# EAGLE design usbmidi v2 (EAGLE 9.6.2)

## Sheet 1 of 2
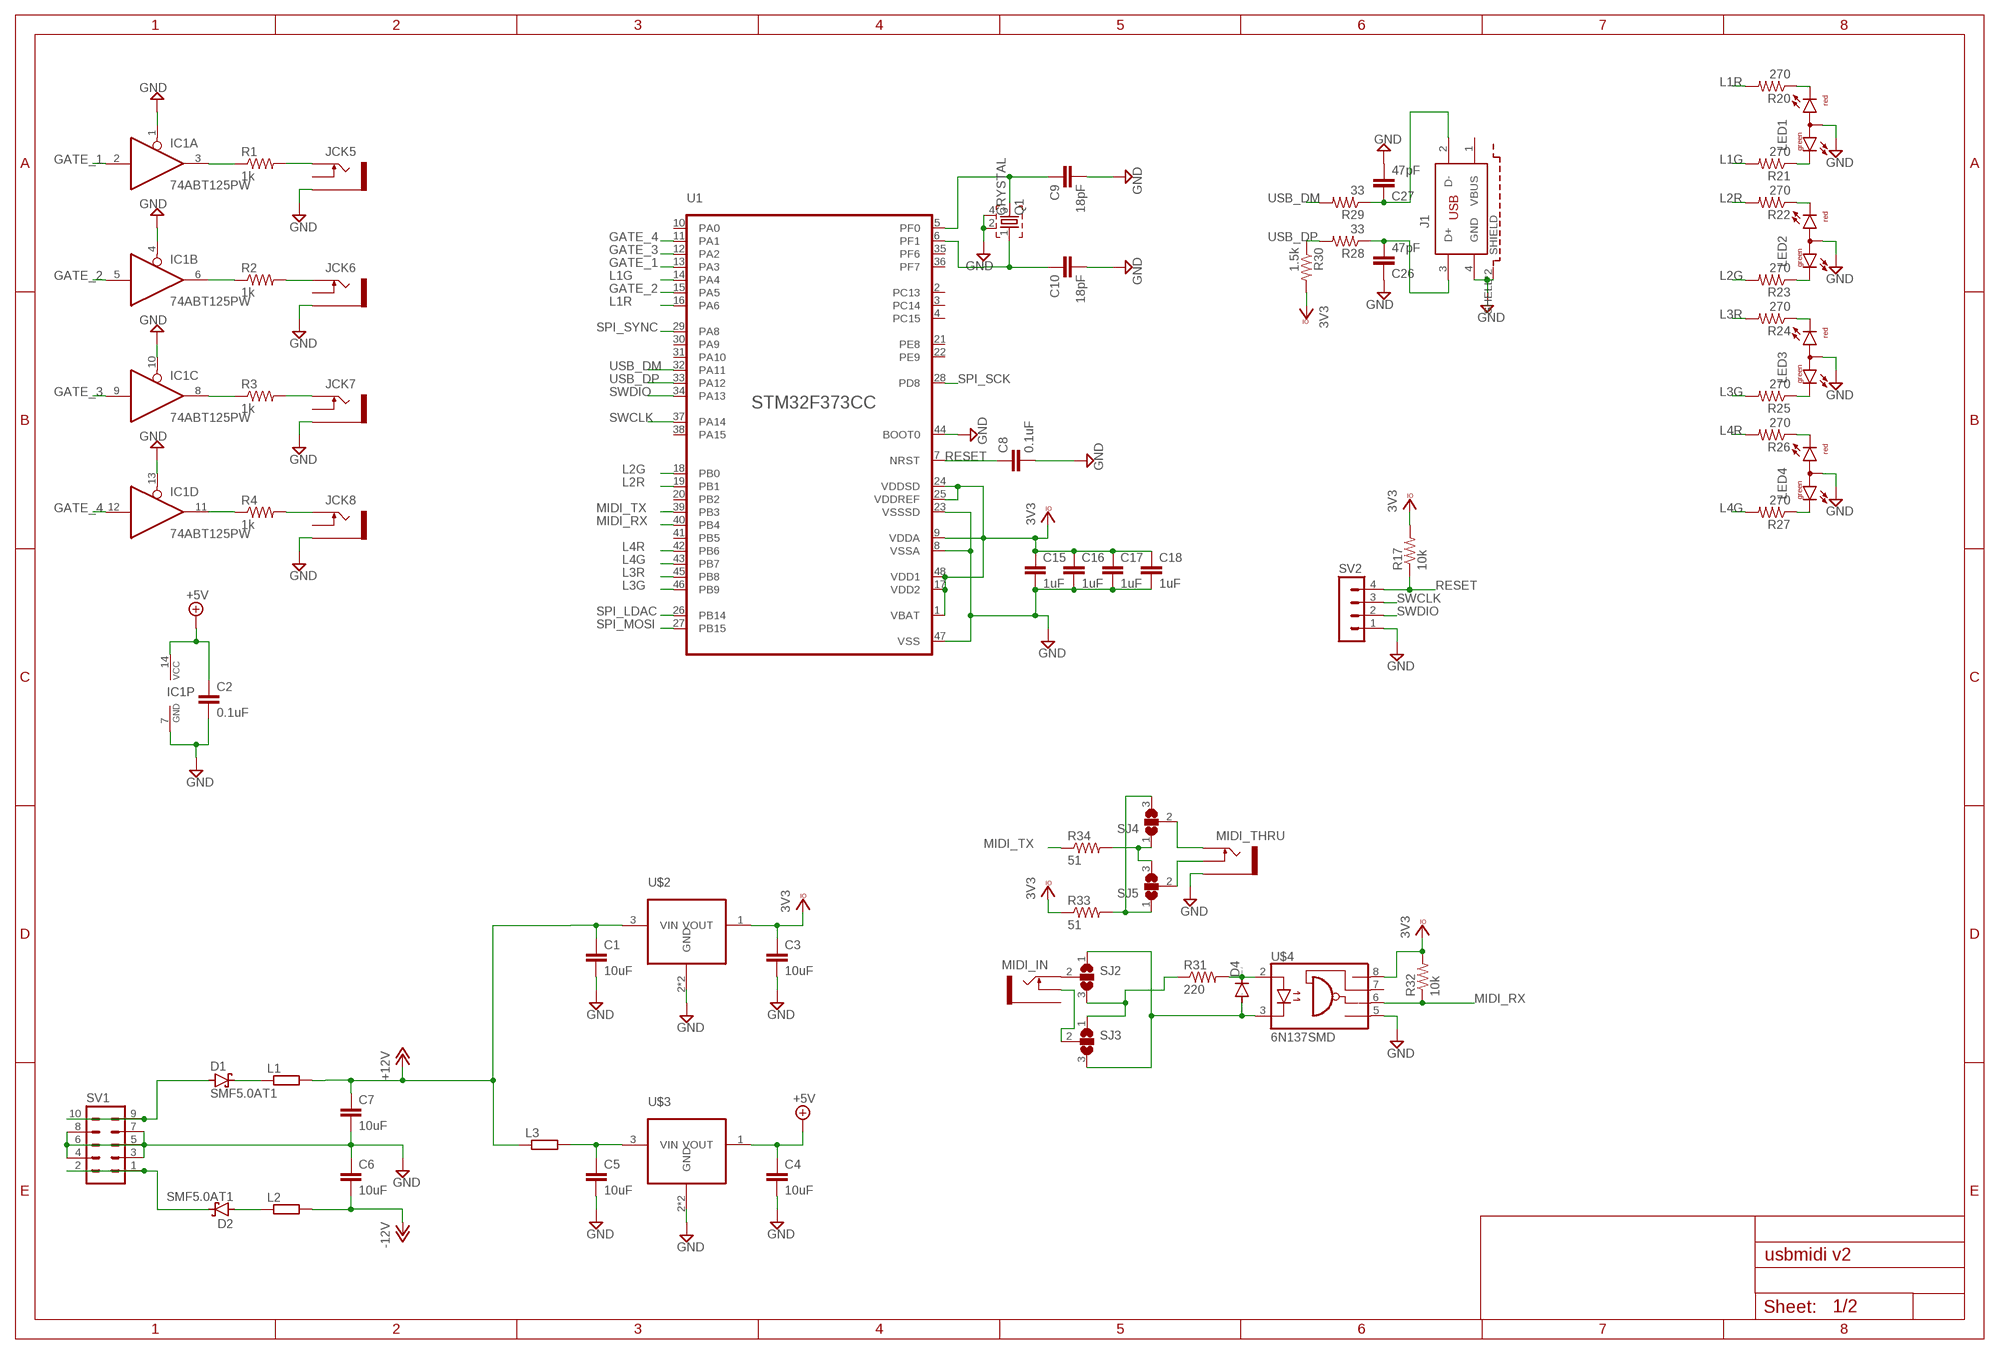
[diagram p0: schematic, sheet 1]

### Parts
C1  10uF  C-EUC0805  [C0805]
C2  0.1uF  C-EUC0603K  [C0603K]
C3  10uF  C-EUC0805  [C0805]
C4  10uF  C-EUC0805  [C0805]
C5  10uF  C-EUC0805  [C0805]
C6  10uF  C-EUC0805  [C0805]
C7  10uF  C-EUC0805  [C0805]
C8  0.1uF  C-EUC0603K  [C0603K]
C9  18pF  C-EUC0603K  [C0603K]
C10  18pF  C-EUC0603K  [C0603K]
C15  1uF  C-EUC0603K  [C0603K]
C16  1uF  C-EUC0603K  [C0603K]
C17  1uF  C-EUC0603K  [C0603K]
C18  1uF  C-EUC0603K  [C0603K]
C26  47pF  C-EUC0603K  [C0603K]
C27  47pF  C-EUC0603K  [C0603K]
D1  SMF5.0AT1  [SOD123FL]
D2  SMF5.0AT1  [SOD123FL]
D4  DIODE-SOD123  [SOD123]
IC1  74ABT125PW  [TSSOP14]
J1  61400413321  [61400413321]
JCK5  THONKICONNNEW  [WQP-PJ301M-12_JACK]
JCK6  THONKICONNNEW  [WQP-PJ301M-12_JACK]
JCK7  THONKICONNNEW  [WQP-PJ301M-12_JACK]
JCK8  THONKICONNNEW  [WQP-PJ301M-12_JACK]
L1  R-EU_R0603  [R0603]
L2  R-EU_R0603  [R0603]
L3  R-EU_R0603  [R0603]
LED1  L-115WEGW-CA  [DUOLED-A-3MM]
LED2  L-115WEGW-CA  [DUOLED-A-3MM]
LED3  L-115WEGW-CA  [DUOLED-A-3MM]
LED4  L-115WEGW-CA  [DUOLED-A-3MM]
MIDI_IN  THONKICONNNEW  [WQP-PJ301M-12_JACK]
MIDI_THRU  THONKICONNNEW  [WQP-PJ301M-12_JACK]
Q1  CRYSTAL  [CTS406]
R1  1k  R-US_R0603  [R0603]
R2  1k  R-US_R0603  [R0603]
R3  1k  R-US_R0603  [R0603]
R4  1k  R-US_R0603  [R0603]
R17  10k  R-US_R0603  [R0603]
R20  270  R-US_R0603  [R0603]
R21  270  R-US_R0603  [R0603]
R22  270  R-US_R0603  [R0603]
R23  270  R-US_R0603  [R0603]
R24  270  R-US_R0603  [R0603]
R25  270  R-US_R0603  [R0603]
R26  270  R-US_R0603  [R0603]
R27  270  R-US_R0603  [R0603]
R28  33  R-US_R0603  [R0603]
R29  33  R-US_R0603  [R0603]
R30  1.5k  R-US_R0603  [R0603]
R31  220  R-US_R0603  [R0603]
R32  10k  R-US_R0603  [R0603]
R33  51  R-US_R0603  [R0603]
R34  51  R-US_R0603  [R0603]
SJ2  SJ2W  [SJ_2]
SJ3  SJ2W  [SJ_2]
SJ4  SJ2W  [SJ_2]
SJ5  SJ2W  [SJ_2]
SV1  MA05-2  [MA05-2]
SV2  MA04-1  [MA04-1]
U1  STM32F373LQFP48  [LQFP48]
U$2  LD2981ABUSOT89  [SOT89]
U$3  LD2981ABUSOT89  [SOT89]
U$4  6N137SMD  [DIL8-SMD]

### Nets
+5V: C2.1 C4.1 IC1.14(P:VCC) U$3.1(VOUT) ; also sheet 2
+12V: C1.1 C7.1 L1.2 L3.1 U$2.3(VIN) ; also sheet 2
-12V: C6.2 L2.2 ; also sheet 2
GATE_1: IC1.2(A:I) U1.13(PA3)
GATE_2: IC1.5(B:I) U1.15(PA5)
GATE_3: IC1.9(C:I) U1.12(PA2)
GATE_4: IC1.12(D:I) U1.11(PA1)
GND: C1.2 C2.2 C3.2 C4.2 C5.2 C6.1 C7.2 C8.2 C9.2 C10.2 C15.2 C16.2 C17.2 C18.2 C26.1 C27.2 IC1.1(A:OE) IC1.4(B:OE) IC1.7(P:GND) IC1.10(C:OE) IC1.13(D:OE) J1.4(GND) J1.SHELL1(SHIELD) J1.SHELL(SHIELD) JCK5.P$3_SLEEVE(SLEEVE) JCK6.P$3_SLEEVE(SLEEVE) JCK7.P$3_SLEEVE(SLEEVE) JCK8.P$3_SLEEVE(SLEEVE) LED1.2(A) LED2.2(A) LED3.2(A) LED4.2(A) MIDI_THRU.P$3_SLEEVE(SLEEVE) Q1.2 Q1.4 SV1.3 SV1.4 SV1.5 SV1.6 SV1.7 SV1.8 SV2.1 U1.8(VSSA) U1.23(VSSSD) U1.44(BOOT0) U1.47(VSS) U$2.2(GND) U$2.2@1(GND) U$3.2(GND) U$3.2@1(GND) U$4.5(GND) ; also sheet 2
L1G: R21.2 U1.14(PA4)
L1R: R20.2 U1.16(PA6)
L2G: R23.2 U1.18(PB0)
L2R: R22.2 U1.19(PB1)
L3G: R25.2 U1.46(PB9)
L3R: R24.2 U1.45(PB8)
L4G: R27.2 U1.43(PB7)
L4R: R26.2 U1.42(PB6)
MIDI_RX: R32.1 U1.40(PB4) U$4.6(VO)
MIDI_TX: R34.1 U1.39(PB3)
N$1: C9.1 Q1.3 U1.5(PF0)
N$2: C26.2 J1.3(D+) R28.1
N$3: C5.1 L3.2 U$3.3(VIN)
N$4: C27.1 J1.2(D-) R29.1
N$5: IC1.3(A:O) R1.1
N$6: IC1.6(B:O) R2.1
N$7: IC1.8(C:O) R3.1
N$8: IC1.11(D:O) R4.1
N$9: JCK5.P$1_TIP(TIP) R1.2
N$10: JCK6.P$1_TIP(TIP) R2.2
N$11: JCK7.P$1_TIP(TIP) R3.2
N$12: JCK8.P$1_TIP(TIP) R4.2
N$16: D4.A SJ2.1 SJ3.3 U$4.3(C)
N$17: D1.C L1.1
N$18: D2.A L2.1
N$19: D2.C SV1.1 SV1.2
N$20: D1.A SV1.9 SV1.10
N$28: LED2.1(CG) R23.1
N$32: LED2.3(CR) R22.1
N$33: LED1.1(CG) R21.1
N$34: R31.1 SJ2.3 SJ3.1
N$35: D4.C R31.2 U$4.2(A)
N$36: MIDI_IN.P$1_TIP(TIP) SJ2.2
N$37: LED1.3(CR) R20.1
N$38: LED4.3(CR) R26.1
N$39: LED4.1(CG) R27.1
N$40: LED3.1(CG) R25.1
N$41: MIDI_IN.P$2_SWITCH(SWITCH) SJ3.2
N$42: LED3.3(CR) R24.1
N$43: C10.1 Q1.1 U1.6(PF1)
N$46: MIDI_THRU.P$2_SWITCH(SWITCH) SJ5.2
N$47: MIDI_THRU.P$1_TIP(TIP) SJ4.2
N$48: R34.2 SJ4.1 SJ5.3
N$49: R33.2 SJ4.3 SJ5.1
RESET: C8.1 R17.1 SV2.4 U1.7(NRST)
SPI_LDAC: U1.26(PB14) ; also sheet 2
SPI_MOSI: U1.27(PB15) ; also sheet 2
SPI_SCK: U1.28(PD8) ; also sheet 2
SPI_SYNC: U1.29(PA8) ; also sheet 2
SWCLK: SV2.3 U1.37(PA14)
SWDIO: SV2.2 U1.34(PA13)
USB_DM: R29.2 U1.32(PA11)
USB_DP: R28.2 R30.1 U1.33(PA12)
VCCIO: C3.1 C15.1 C16.1 C17.1 C18.1 R17.2 R30.2 R32.2 R33.1 U1.1(VBAT) U1.9(VDDA) U1.17(VDD2) U1.24(VDDSD) U1.25(VDDREF) U1.48(VDD1) U$2.1(VOUT) U$4.8(VCC) ; supply symbol labelled 3V3 ; also sheet 2
Unconnected: J1.1(VBUS) JCK5.P$2_SWITCH(SWITCH) JCK6.P$2_SWITCH(SWITCH) JCK7.P$2_SWITCH(SWITCH) JCK8.P$2_SWITCH(SWITCH) MIDI_IN.P$3_SLEEVE(SLEEVE) U1.2(PC13) U1.3(PC14) U1.4(PC15) U1.10(PA0) U1.20(PB2) U1.21(PE8) U1.22(PE9) U1.30(PA9) U1.31(PA10) U1.35(PF6) U1.36(PF7) U1.38(PA15) U1.41(PB5) U$4.7(VE)

## Sheet 2 of 2
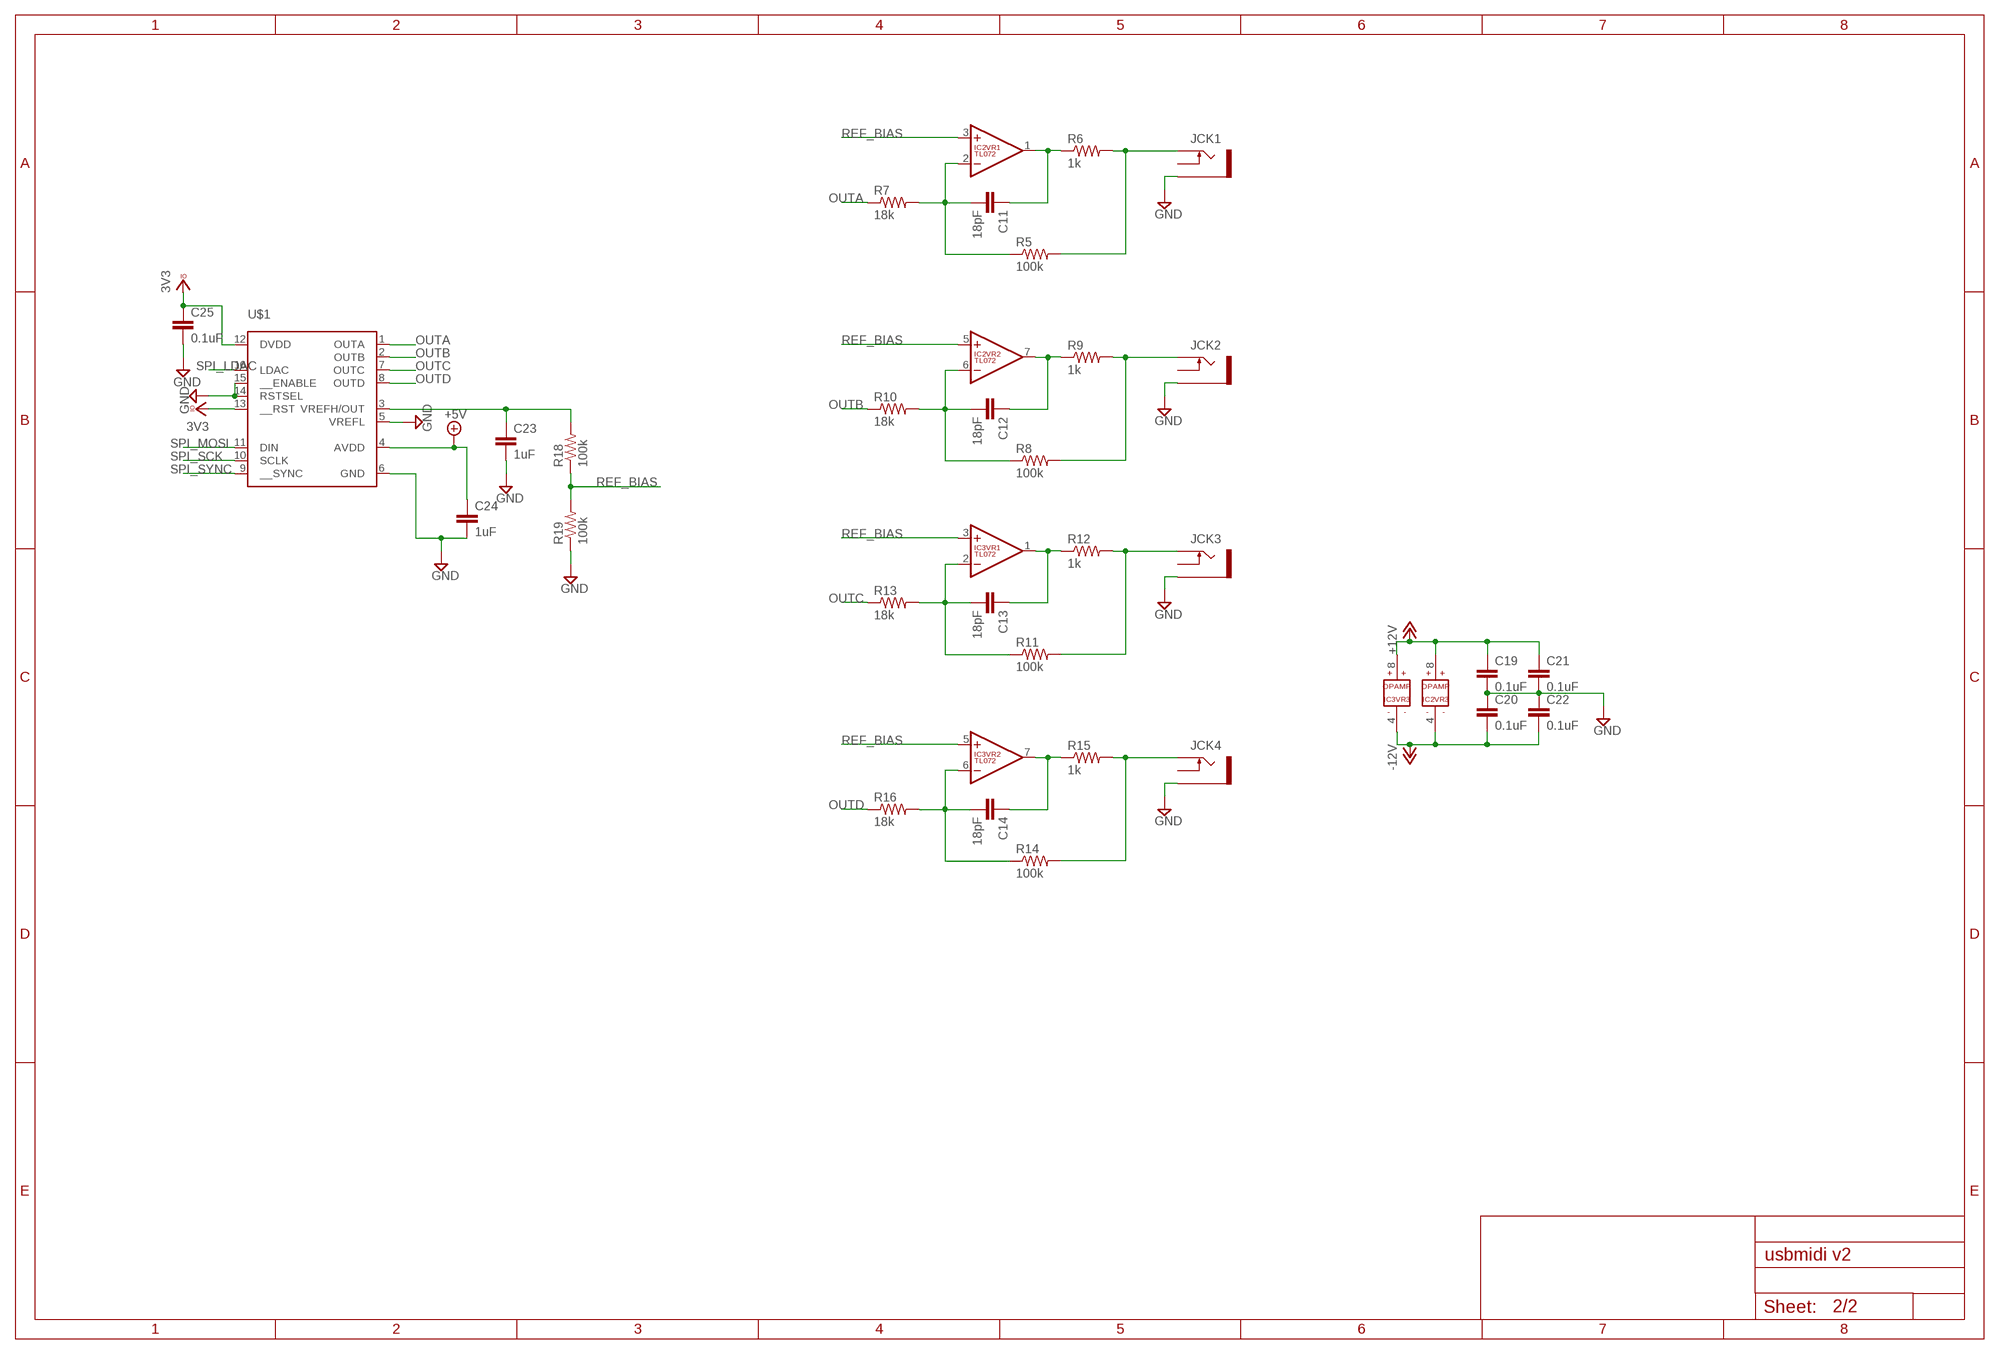
[diagram p1: schematic, sheet 2]

### Parts
C11  18pF  C-EUC0603K  [C0603K]
C12  18pF  C-EUC0603K  [C0603K]
C13  18pF  C-EUC0603K  [C0603K]
C14  18pF  C-EUC0603K  [C0603K]
C19  0.1uF  C-EUC0603K  [C0603K]
C20  0.1uF  C-EUC0603K  [C0603K]
C21  0.1uF  C-EUC0603K  [C0603K]
C22  0.1uF  C-EUC0603K  [C0603K]
C23  1uF  C-EUC0603K  [C0603K]
C24  1uF  C-EUC0603K  [C0603K]
C25  0.1uF  C-EUC0603K  [C0603K]
IC2  TL072  [SO08]
IC3  TL072  [SO08]
JCK1  THONKICONNNEW  [WQP-PJ301M-12_JACK]
JCK2  THONKICONNNEW  [WQP-PJ301M-12_JACK]
JCK3  THONKICONNNEW  [WQP-PJ301M-12_JACK]
JCK4  THONKICONNNEW  [WQP-PJ301M-12_JACK]
R5  100k  R-US_R0603  [R0603]
R6  1k  R-US_R0603  [R0603]
R7  18k  R-US_R0603  [R0603]
R8  100k  R-US_R0603  [R0603]
R9  1k  R-US_R0603  [R0603]
R10  18k  R-US_R0603  [R0603]
R11  100k  R-US_R0603  [R0603]
R12  1k  R-US_R0603  [R0603]
R13  18k  R-US_R0603  [R0603]
R14  100k  R-US_R0603  [R0603]
R15  1k  R-US_R0603  [R0603]
R16  18k  R-US_R0603  [R0603]
R18  100k  R-US_R0603  [R0603]
R19  100k  R-US_R0603  [R0603]
U$1  DAC8565  [TSSOP16]

### Nets
+5V: C24.1 U$1.4(AVDD) ; also sheet 1
+12V: C19.1 C21.1 IC2.8(VR3:V+) IC3.8(VR3:V+) ; also sheet 1
-12V: C20.2 C22.2 IC2.4(VR3:V-) IC3.4(VR3:V-) ; also sheet 1
GND: C19.2 C20.1 C21.2 C22.1 C23.2 C24.2 C25.2 JCK1.P$3_SLEEVE(SLEEVE) JCK2.P$3_SLEEVE(SLEEVE) JCK3.P$3_SLEEVE(SLEEVE) JCK4.P$3_SLEEVE(SLEEVE) R19.1 U$1.5(VREFL) U$1.6(GND) U$1.14(RSTSEL) U$1.15(__ENABLE) ; also sheet 1
N$13: C11.2 IC2.2(VR1:-IN) R5.1 R7.2
N$14: C11.1 IC2.1(VR1:OUT) R6.1
N$15: JCK1.P$1_TIP(TIP) R5.2 R6.2
N$21: C12.2 IC2.6(VR2:-IN) R8.1 R10.2
N$22: C12.1 IC2.7(VR2:OUT) R9.1
N$23: JCK2.P$1_TIP(TIP) R8.2 R9.2
N$24: C23.1 R18.2 U$1.3(VREFH/OUT)
N$25: C13.2 IC3.2(VR1:-IN) R11.1 R13.2
N$26: C13.1 IC3.1(VR1:OUT) R12.1
N$27: JCK3.P$1_TIP(TIP) R11.2 R12.2
N$29: C14.2 IC3.6(VR2:-IN) R14.1 R16.2
N$30: C14.1 IC3.7(VR2:OUT) R15.1
N$31: JCK4.P$1_TIP(TIP) R14.2 R15.2
OUTA: R7.1 U$1.1(OUTA)
OUTB: R10.1 U$1.2(OUTB)
OUTC: R13.1 U$1.7(OUTC)
OUTD: R16.1 U$1.8(OUTD)
REF_BIAS: IC2.3(VR1:+IN) IC2.5(VR2:+IN) IC3.3(VR1:+IN) IC3.5(VR2:+IN) R18.1 R19.2
SPI_LDAC: U$1.16(LDAC) ; also sheet 1
SPI_MOSI: U$1.11(DIN) ; also sheet 1
SPI_SCK: U$1.10(SCLK) ; also sheet 1
SPI_SYNC: U$1.9(__SYNC) ; also sheet 1
VCCIO: C25.1 U$1.12(DVDD) U$1.13(__RST) ; supply symbol labelled 3V3 ; also sheet 1
Unconnected: JCK1.P$2_SWITCH(SWITCH) JCK2.P$2_SWITCH(SWITCH) JCK3.P$2_SWITCH(SWITCH) JCK4.P$2_SWITCH(SWITCH)

## Library data of the parts
C1-C27 = resistor:C-EU: CAPACITOR, European symbol
D1 D2 = diode:SMF5.0AT1: 200 W Transient Voltage Suppressor Source: Data sheet <http://www.onsemi.com/pub_link/Collateral/SMF5.0AT1-D.PDF>
D4 = diode:DIODE-: DIODE
IC1 = 74xx-eu:74*125: Quad bus BUFFER, 3-state
IC2 IC3 = EurorackModularParts:TL072
J1 = Wurth_Elektronik_Electromechanic_Input-Output_Connectors_rev19a:61400413321: WR-COM Vertical USB Type B,4 pins=>Code : Con_I-O_COM_USB-2.0_B_61400413321 <http://katalog.we-online.de/media/images/v2/Family_S290_WR-COM_USB_TypeB_61400413321_4C.jpg> Details see: http://katalog.we-online.de/en/em/COM_TYPE_B_VERTICAL Created 2014-07-09, Karrer Zheng 2014 (C) Würth Elektronik
JCK1-JCK8 MIDI_IN MIDI_THRU = BitFox:THONKICONN: 3.5mm socket for Eurorack modular synths
L1-L3 = resistor:R-EU_: RESISTOR, European symbol
LED1-LED4 = led:L-115WEGW-CA: T-1(3mm) BI-COLOR INDICATOR LAMP Source: Kingbright .. 2_colour_led_.pdf
Q1 = BitFox:CRYSTAL
R1-R34 = resistor:R-US_: RESISTOR, American symbol
SJ2-SJ5 = jumper:SJ2W: SMD solder JUMPER
SV1 = con-lstb:MA05-2: PIN HEADER; OC_FARNELL: unknown; OC_NEWARK: unknown
SV2 = con-lstb:MA04-1: PIN HEADER; OC_FARNELL: unknown; OC_NEWARK: unknown
U1 = BitFox:STM32F373
U$1 = BitFox:DAC8565
U$2 U$3 = BitFox:LD2981ABU
U$4 = optocoupler:6N137SMD

## Board
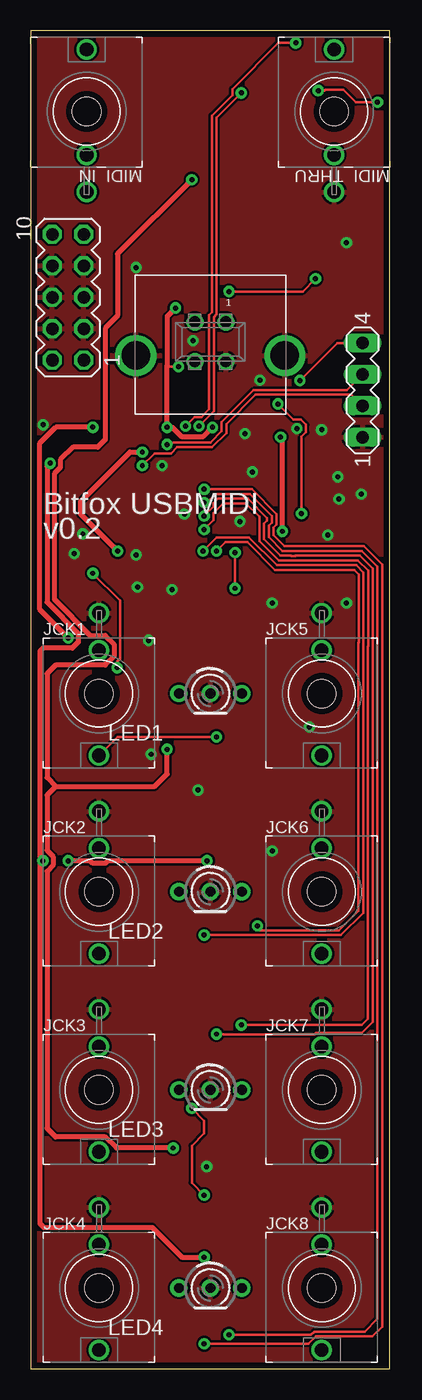
[diagram p2: board, top side]
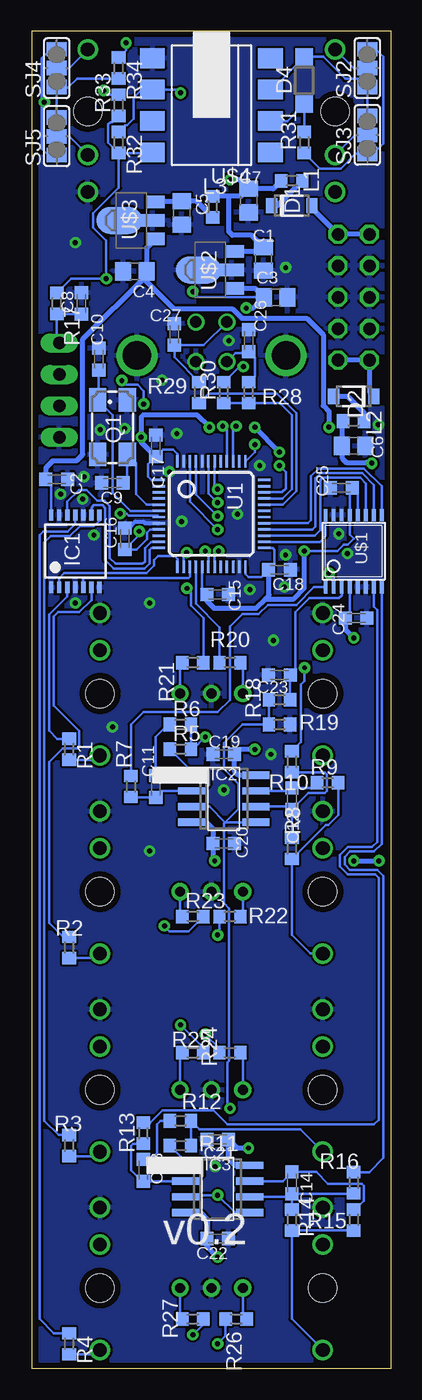
[diagram p3: board, bottom side, seen from below]

Size 29 x 108 mm. Coordinates in mm from the lower left corner, seen from the top.
Outline: 0,0 29,0 29,108 0,108 0,0
Copper layers (1*16): Top 0.035mm / dielectric 1.5mm / Bottom 0.035mm
Design rules "PCBCart-Standard *": minimum track width 7mil, minimum drill 0.4mm, track to track 7mil, track to pad 7mil, pad to pad 7mil, via to via 7mil, smd to smd 7mil, copper to edge 20mil, drill to drill 8mil, minimum pad ring 8mil, minimum via ring 10mil, stop-mask expansion 3mil, vias tented up to drill 25mil, thermal gap 8mil

### Footprints (pad centres in the part's own frame; a part is rotated, then mirrored left to right if it is on the bottom)
C0805 = smd 1.3 x 1.5: 1 -0.95,0; 2 0.95,0
C0603K = smd 1.05 x 1.08: 1 -0.875,0; 2 0.875,0
SOD123FL = smd 0.91 x 1.22: A 1.625,0; C -1.625,0
SOD123 = smd 1.4 x 1.4: A 1.9,0; C -1.9,0
TSSOP14 = smd 0.35 x 0.9: 1 -1.95,-2.925; 2 -1.3,-2.925; 3 -0.65,-2.925; 4 0,-2.925; 5 0.65,-2.925; 6 1.3,-2.925; 7 1.95,-2.925; 8 1.95,2.925; 9 1.3,2.925; 10 0.65,2.925; 11 0,2.925; 12 -0.65,2.925; 13 -1.3,2.925; 14 -1.95,2.925
SO08 = smd 0.6 x 2.2: 1 -1.905,-2.6; 2 -0.635,-2.6; 3 0.635,-2.6; 4 1.905,-2.6; 5 1.905,2.6; 6 0.635,2.6; 7 -0.635,2.6; 8 -1.905,2.6
61400413321 = drill 0.92: 1 1.25,0; 2 -1.25,0; 3 -1.25,-3.2; 4 1.25,-3.2 | drill 2.3: SHELL -6.02,-2.7; SHELL1 6.02,-2.7
WQP-PJ301M-12_JACK = drill 1.1: P$1_TIP 0,5; P$2_SWITCH 0,-3.5; P$3_SLEEVE 0,-6.5 | hole 2.286: 0,0
R0603 = smd 1 x 1.1: 1 -0.85,0; 2 0.85,0
DUOLED-A-3MM = drill 0.8 pad 1.4: 1 -2.54,0; 2 0,0; 3 2.54,0
CTS406 = smd 1.9 x 1.4: 1 -2.2,-1.2; 2 2.2,-1.2; 3 2.2,1.2; 4 -2.2,1.2
SJ_2 = smd 1.168 x 1.6: 1 -1.524,0; 2 0,0; 3 1.524,0
MA05-2 = drill 1.016 octagon: 1 -5.08,-1.27; 2 -5.08,1.27; 3 -2.54,-1.27; 4 -2.54,1.27; 5 0,-1.27; 6 0,1.27; 7 2.54,-1.27; 8 2.54,1.27; 9 5.08,-1.27; 10 5.08,1.27
MA04-1 = drill 1.016 long: 1 -3.81,0; 2 -1.27,0; 3 1.27,0; 4 3.81,0
LQFP48 = smd 1 x 0.2: 1 -4.25,2.75; 2 -4.25,2.25; 3 -4.25,1.75; 4 -4.25,1.25; 5 -4.25,0.75; 6 -4.25,0.25; 7 -4.25,-0.25; 8 -4.25,-0.75; 9 -4.25,-1.25; 10 -4.25,-1.75; 11 -4.25,-2.25; 12 -4.25,-2.75; 25 4.25,-2.75; 26 4.25,-2.25; 27 4.25,-1.75; 28 4.25,-1.25; 29 4.25,-0.75; 30 4.25,-0.25; 31 4.25,0.25; 32 4.25,0.75; 33 4.25,1.25; 34 4.25,1.75; 35 4.25,2.25; 36 4.25,2.75 | smd 0.2 x 1: 13 -2.75,-4.25; 14 -2.25,-4.25; 15 -1.75,-4.25; 16 -1.25,-4.25; 17 -0.75,-4.25; 18 -0.25,-4.25; 19 0.25,-4.25; 20 0.75,-4.25; 21 1.25,-4.25; 22 1.75,-4.25; 23 2.25,-4.25; 24 2.75,-4.25; 37 2.75,4.25; 38 2.25,4.25; 39 1.75,4.25; 40 1.25,4.25; 41 0.75,4.25; 42 0.25,4.25; 43 -0.25,4.25; 44 -0.75,4.25; 45 -1.25,4.25; 46 -1.75,4.25; 47 -2.25,4.25; 48 -2.75,4.25
TSSOP16 = smd 0.305 x 0.991: 1 -2.275,-2.918; 2 -1.625,-2.918; 3 -0.975,-2.918; 4 -0.325,-2.918; 5 0.325,-2.918; 6 0.975,-2.918; 7 1.625,-2.918; 8 2.275,-2.918; 9 2.275,2.918; 10 1.625,2.918; 11 0.975,2.918; 12 0.325,2.918; 13 -0.325,2.918; 14 -0.975,2.918; 15 -1.625,2.918; 16 -2.275,2.918
SOT89 = smd 1 x 1.5: 1 -1.499,-1.981; 3 1.499,-1.981 | smd 1 x 2: 2 0,-1.727 | smd 2.2 x 3.7: 2@1 0,0.94
DIL8-SMD = smd 1.6 x 2: 1 -3.81,-4.77; 2 -1.27,-4.77; 3 1.27,-4.77; 4 3.81,-4.77; 5 3.81,4.77; 6 1.27,4.77; 7 -1.27,4.77; 8 -3.81,4.77

### Placement (x,y rotation side)
C1  10.3,89.6 270 bottom
C2  27,71.8 0 bottom
C3  9.3,86.5 0 bottom
C4  20.7,88.6 180 bottom
C5  16.9,93.3 270 bottom
C6  3,74.5 180 bottom
C7  11.5,94.3 270 bottom
C8  25,86 90 bottom
C9  22.5,71.5 180 bottom
C10  23.6,81.5 90 bottom
C11  19,47 270 bottom
C12  8,46 270 bottom
C13  20,16 270 bottom
C14  8,15 270 bottom
C15  14,62.5 0 bottom
C16  21.5,67 90 bottom
C17  19,74.5 90 bottom
C18  9,64.5 0 bottom
C19  13.5,49.6 180 bottom
C20  13.5,42.4 180 bottom
C21  14,18.5 180 bottom
C22  14,10.5 180 bottom
C23  9,56 180 bottom
C24  2.8,60.6 0 bottom
C25  4,71.1 180 bottom
C26  11.5,83 270 bottom
C27  17.5,83.5 90 bottom
D1  8,93.9 0 bottom
D2  3,78.5 180 bottom
D4  7,104 90 bottom
IC1  25.5,66 0 bottom
IC2  13.5,46 270 bottom
IC3  14,14.5 270 bottom
J1  14.5,84.5 0 top
JCK1  5.5,54.5 180 top
JCK2  5.5,38.5 180 top
JCK3  5.5,22.5 180 top
JCK4  5.5,6.5 180 top
JCK5  23.5,54.5 180 top
JCK6  23.5,38.5 180 top
JCK7  23.5,22.5 180 top
JCK8  23.5,6.5 180 top
L1  8,95.9 180 bottom
L2  3,76.5 180 bottom
L3  14.4,93.8 270 bottom
LED1  14.5,54.5 180 top
LED2  14.5,38.5 180 top
LED3  14.5,22.5 180 top
LED4  14.5,6.5 180 top
MIDI_IN  4.5,101.5 0 top
MIDI_THRU  24.5,101.5 0 top
Q1  22.5,76 270 bottom
R1  26,50 270 bottom
R2  26,34 270 bottom
R3  26,18 270 bottom
R4  26,2 270 bottom
R5  17,50 0 bottom
R6  17,52 0 bottom
R7  21,47 270 bottom
R8  8,42 270 bottom
R9  5.1,47.3 0 bottom
R10  8,49 270 bottom
R11  17,18 0 bottom
R12  17,20 0 bottom
R13  20,19 270 bottom
R14  8,12 270 bottom
R15  3,12 270 bottom
R16  3,15 270 bottom
R17  27,86 90 bottom
R18  9,54 0 bottom
R19  9,52 180 bottom
R20  13,57 180 bottom
R21  16,57 0 bottom
R22  13,36.5 180 bottom
R23  16,36.5 0 bottom
R24  13,25.5 180 bottom
R25  16,25.5 0 bottom
R26  12.5,4 180 bottom
R27  16,4 0 bottom
R28  11.5,78.8 270 bottom
R29  15.5,78.8 270 bottom
R30  13.5,78.8 90 bottom
R31  7,99 90 bottom
R32  22,99 270 bottom
R33  22,102 90 bottom
R34  22,105 270 bottom
SJ2  1.9,105 90 bottom
SJ3  1.9,99.6 90 bottom
SJ4  27,105 90 bottom
SJ5  27,99.5 90 bottom
SV1  3,86.5 90 top
SV2  26.8,79 90 top
U1  14.5,69 0 bottom
U$1  3,66 0 bottom
U$2  14.6,88.7 90 bottom
U$3  21,92.7 90 bottom
U$4  14.5,102 90 bottom

### Tracks (layer width: path | path; a pad name or v marks a point on that pad's centre or on a via)
+5V  (via drill 0.4)
  Top 0.406: v5,76 2,76 0.71,74.71 0.71,61.29 v3,59
  Bottom 0.203: C24.1 3.33,60.95 U$1.4 | IC1.14 27.45,71.38 C2.1
  Bottom 0.406: U$3.1 19.75,90.47 C4.1 | C4.1 19.75,88.25 24.89,83.11 24.89,73.81 25.4,73.3 27.3,73.3 27.88,72.72 C2.1 | v5,76 5,77.27 5.46,77.73 5.46,83.46 6.8,84.8 12.04,84.8 12.81,85.57 17.57,85.57 19.75,87.75 C4.1 | C24.1 3.67,59.67 v3,59
+12V  (via drill 0.4)
  Top 0.406: v13,96 7,90 7,85 6,84 6,75 5.4,74.4 3.4,74.4 2.38,73.38 2.38,72.75 1.88,72.25 1.88,62.13 4.8,59.21 6,59.21 6.71,58.5 6.71,57.5 6,56.79 1.99,56.79 1.29,56.1 1.29,47.7 2,47 | 2,47 1.29,46.3 1.29,41.85 1.8,41.35 1.8,40.65 1.29,40.15 1.29,19.4 1.99,18.71 6,18.71 6.91,17.8 v11.5,17.8 | 2,47 10,47 11,48 v11,50
  Bottom 0.406: L1.2 9.5,95.25 C7.1 | C7.1 12.1,94.65 13.1,94.65 | 13.1,94.65 L3.1 | U$2.3 10.65,90.2 C1.1 11.25,91.5 12.8,91.5 13.1,91.8 13.1,94.65 | C7.1 12.25,96 v13,96 | IC2.8 12.3,47.91 12.62,48.23 C19.1 12.22,50 v11,50 | IC3.8 12.61,16.41 13.12,16.93 C21.1 12.43,17.8 v11.5,17.8
-12V  (via drill 0.4)
  Top 0.406: v1.55,73.1 1.29,72.84 1.29,61.88 3.83,59.35 3.83,58.65 3.35,58.16 0.98,58.16 0.71,57.9 0.71,41.25 | v14.23,41 6.21,41 6,40.79 5,40.79 4.79,41 v3,41 | 0.71,41.25 0.71,40.75 | v14,9 12.2,9 9.8,11.4 1.02,11.4 0.71,11.71 0.71,40 0.71,40.75 | 0.71,41.25 v0.96,41 0.71,40.75
  Bottom 0.406: L2.2 3.95,76.4 C6.2 3.95,73.51 3.6,73.16 1.97,73.16 1.9,73.1 v1.55,73.1 | IC2.4 14.89,44.09 14.38,43.58 C20.2 14.38,41.14 v14.23,41 | IC3.4 15.39,12.6 14.8,12 14.8,10.57 C22.2 14.88,9.88 v14,9 | v3,41 v0.96,41
GATE_1
  Bottom 0.203: IC1.2 26.8,63.8 26.38,64.22 19.74,64.22 19.12,64.84 19.12,65.3 18.82,65.6 17.5,65.6 17.25,65.35 U1.13
GATE_2
  Bottom 0.203: IC1.5 24.85,63.79 24.8,63.84 18,63.84 17.98,63.84 16.36,63.84 16.25,63.95 U1.15
GATE_3
  Bottom 0.203: U1.12 19.35,66.25 19.5,66.1 19.5,65 19.9,64.6 22.4,64.6 23.1,65.3 23.1,69.49 23.3,69.7 24,69.7 24.2,69.5 IC1.9
GATE_4
  Bottom 0.203: U1.11 19.39,66.75 19.88,66.26 19.88,65.16 20.06,64.98 22.24,64.98 22.71,65.45 22.71,69.65 23.15,70.08 23.74,70.08 24.6,70.93 25.2,70.93 26.15,69.99 IC1.12
GND  (via drill 0.4)
  Bottom 0.305: C16.2 21.16,67.88 20.65,68.38 20,68.38 19.87,68.25 U1.8
  other vias: 25.5,61.8 19.5,61.8 23.5,75.8 18.5,79.8 13.1,83 8.5,88.9 25.5,90.9 24,67.3 24.9,70.2 16.9,68.4 12.4,69 10.6,72.9 17.9,72.4 17.3,75.5 21.5,75.9 9.5,58.8 3.5,65.8 11.4,62.9 8.5,65.7 8.6,63.1 4.2,67.4 24.8,72 26.7,70.6 22.5,51.8 19.5,41.8 14.2,16.3 13.5,46.7 9.7,49.6 1,76.2
  pour Bottom: 29,108 29,0 0,0 0,108
  pour Top: 29,108 29,0 0,0 0,108
L1G  (via drill 0.4)
  Top 0.203: v16.5,65.88 16.5,63.02 v16.48,63
  Bottom 0.203: R21.2 15.15,60.61 16.13,61.59 16.13,62.65 v16.48,63 | U1.14 16.75,65.63 v16.5,65.88
L1R
  Bottom 0.203: U1.16 15.75,61.75 13.85,59.85 R20.2
L2G  (via drill 0.4)
  Top 0.203: v15,66 15.72,66.72 17.48,66.72 19.72,64.48 26.12,64.48 26.48,64.11 26.48,58.64 26.48,58.63 26.48,36.96 24.9,35.38 18.5,35.38 18.3,35.58 v18.3,35.73
  Bottom 0.203: U1.18 14.75,65.75 v15,66 | v18.3,35.73 17.87,35.3 16.35,35.3 R23.2
L2R  (via drill 0.4)
  Top 0.203: v13.91,66 15.01,67.1 17.64,67.1 19.88,64.86 26.28,64.86 26.87,64.27 26.87,58.48 26.86,58.47 26.86,36.8 25.06,35 v14,35
  Bottom 0.203: U1.19 14.25,65.66 v13.91,66 | v14,35 13.85,35.15 R22.2
L3G  (via drill 0.4)
  Top 0.203: v14,67.74 14,67.79 14.73,68.53 14.73,69.07 15.52,69.86 17.37,69.86 18.45,68.78 18.45,66.82 20.04,65.24 26.44,65.24 27.25,64.43 27.25,58.33 27.24,58.32 27.24,28.24 26.73,27.73 v17,27.73
  Bottom 0.203: U1.46 16.25,69.99 v14,67.74 | v17,27.73 15.15,25.88 R25.2
L3R  (via drill 0.4)
  Top 0.203: v14,68.83 14,68.88 14.73,69.61 14.73,69.87 15.1,70.24 17.53,70.24 19.08,68.68 19.08,68.47 18.83,68.22 18.83,66.98 20.18,65.64 21.02,65.64 21.04,65.62 21.36,65.62 21.38,65.64 26.57,65.64 27.63,64.58 27.63,58.17 27.62,58.16 27.62,28 26.72,27.1 23.04,27.1 22.94,27 v15,27
  Bottom 0.203: U1.45 15.75,70.58 v14,68.83 | v15,27 13.85,25.85 R24.2
L4G  (via drill 0.4)
  Top 0.203: v14,69.91 14.21,69.91 14.92,70.62 17.69,70.62 19.46,68.84 19.46,68.31 19.21,68.06 19.21,67.14 20.33,66.02 21.18,66.02 26.73,66.02 28.01,64.74 28.01,58.01 28,58 28,4 26.98,2.98 22.89,2.98 22.63,2.73 v16,2.73
  Bottom 0.203: U1.43 14.75,70.66 v14,69.91 | v16,2.73 15.15,3.58 R27.2
L4R  (via drill 0.4)
  Top 0.203: v14,71 17.85,71 19.85,69 19.85,68.16 19.59,67.9 19.59,67.3 20.49,66.4 26.89,66.4 28.39,64.9 28.39,58 28.39,57.8 28.39,3.39 27.6,2.6 23.04,2.6 22.44,2 v14,2
  Bottom 0.203: U1.42 14.25,71.25 v14,71 | v14,2 13.35,2.65 R26.2
MIDI_RX  (via drill 0.4)
  Top 0.203: v13.59,76.1 14.78,77.3 14.78,84.9 15,85.12 15,101 v17,103
  Bottom 0.203: R32.1 21.48,100.37 21.33,100.37 20.8,100.91 20.8,102.6 20.13,103.27 U$4.6 17.27,103.27 v17,103 | U1.40 13.25,75.76 v13.59,76.1
MIDI_TX  (via drill 0.4)
  Top 0.203: v12.5,76.1 13.23,76.83 13.78,76.83 14.4,77.45 14.4,85.06 14.62,85.28 14.62,101.16 16.27,102.81 16.27,103.3 20,107.04 v21.4,107.04
  Bottom 0.203: U1.39 12.75,75.85 v12.5,76.1 | v21.4,107.04 21.4,106.45 R34.1
N$1
  Bottom 0.203: U1.5 19.75,69.75 20.6,70.6 20.6,73.1 Q1.3 21.3,71.83 C9.1
N$2
  Bottom 0.203: J1.3 12.55,82 11.5,82 C26.2 11,81.62 11,80.15 R28.1
N$3
  Bottom 0.406: L3.2 15.7,94.25 C5.1 16.95,94.2 U$3.3
N$4
  Bottom 0.203: J1.2 15.12,82.62 C27.1 17.5,81.65 R29.1
N$5
  Bottom 0.203: IC1.3 26.15,62.35 27.63,60.87 27.63,51.53 26.95,50.85 R1.1
N$6
  Bottom 0.203: IC1.6 24.2,63 24.2,62.6 24.2,62.06 25.2,61.07 26.89,61.07 27.25,60.71 27.25,53.54 25.17,51.47 25.17,50.23 25.33,50.07 26.52,50.07 27.63,48.97 27.63,36 26.48,34.85 R2.1
N$7
  Bottom 0.203: R3.1 26.85,18.85 28.01,20.01 28.01,66.7 27.49,67.22 25.94,67.22 25.13,68.03 24,68.03 23.55,68.48 IC1.8
N$8
  Bottom 0.203: IC1.11 25.5,68.2 26.1,67.6 28.1,67.6 28.39,67.31 28.39,4 27.24,2.85 R4.1
N$9
  Bottom 0.203: R1.2 23.85,49.15 JCK5.P$1_TIP
N$10
  Bottom 0.203: R2.2 23.85,33.15 JCK6.P$1_TIP
N$11
  Bottom 0.203: R3.2 23.85,17.15 JCK7.P$1_TIP
N$12
  Bottom 0.203: R4.2 23.85,1.15 JCK8.P$1_TIP
N$13
  Bottom 0.203: R7.2 20.98,46.12 C11.2 18.49,46.63 IC2.2 15.16,46.63 14.7,47.1 14.7,48.3 14.88,48.48 16.33,48.48 R5.1
N$14
  Bottom 0.203: IC2.1 18.97,47.91 C11.1 19,51 18,52 R6.1
N$15  (via drill 0.4)
  Top 0.203: v15,51 7,51 JCK1.P$1_TIP
  Bottom 0.203: R6.2 R5.2 16,50 v15,51
N$16
  Bottom 0.203: SJ3.3 SJ2.1 2.56,104.14 3.7,104.14 5.46,105.9 D4.A 9.63,103.27 U$4.3
N$17
  Bottom 0.406: D1.C 9.15,93.9 L1.1
N$18
  Bottom 0.406: D2.A 3.5,78.5 2.15,77.15 L2.1
N$19
  Bottom 0.406: SV1.1 SV1.2 1.73,78.86 D2.C
N$20
  Bottom 0.406: SV1.10 SV1.9 6.38,93.69 D1.A
N$21
  Bottom 0.203: IC2.6 8.24,45.37 C12.2 | C12.2 6.65,46.47 5.33,46.47 5.17,46.63 5.17,47.97 5.33,48.13 7.98,48.13 R10.2 | R8.1 C12.2
N$22
  Bottom 0.203: IC2.7 8.24,46.63 C12.1 6.38,46.88 R9.1
N$23
  Bottom 0.203: R9.2 4.25,44.69 5.04,43.9 5.25,43.9 R8.2 8,35 6.5,33.5 JCK2.P$1_TIP
N$24
  Bottom 0.203: U$1.3 3.98,62.42 4.2,62.2 6.58,62.2 7.7,61.08 7.7,56.42 C23.1 8.15,55.98 R18.2
N$25
  Bottom 0.203: R13.2 20.85,18.15 21,18 21,16 20.12,15.12 C13.2 16.7,15.12 IC3.2 | IC3.2 | R11.1 16.83,16.98 15.38,16.98 15.22,16.82 15.22,15.58 15.68,15.12 IC3.2
N$26
  Bottom 0.203: IC3.1 19.53,16.41 C13.1 19.88,17 19.3,17 18.9,17.4 18.9,19.7 18.6,20 R12.1
N$27
  Bottom 0.203: R11.2 R12.2 15.47,19.32 7.32,19.32 JCK3.P$1_TIP
N$28
  Bottom 0.203: LED2.1 17.04,36.69 R23.1
N$29
  Bottom 0.203: C14.2 8.26,13.87 IC3.6 | C14.2 R14.1 | C14.2 3.02,14.12 R16.2
N$30
  Bottom 0.203: IC3.7 8.74,15.13 C14.1 6.03,15.88 5.08,14.93 2.33,14.93 2.17,14.77 2.17,13.53 2.85,12.85 R15.1
N$31
  Bottom 0.203: R15.2 R14.2 8,4 JCK4.P$1_TIP
N$32
  Bottom 0.203: R22.1 11.96,36.69 LED2.3
N$33
  Bottom 0.203: R21.1 17.04,56.81 LED1.1
N$34
  Bottom 0.203: SJ2.3 1.23,106.52 0.61,105.9 0.61,98.9 1.43,98.08 SJ3.1 2.86,98.08 4.04,96.9 5.75,96.9 R31.1
N$35
  Bottom 0.203: R31.2 D4.C 8.37,100.73 U$4.2
N$36
  Bottom 0.203: MIDI_IN.P$1_TIP 3,105 SJ2.2
N$37
  Bottom 0.203: LED1.3 11.96,56.81 R20.1
N$38
  Bottom 0.203: LED4.3 11.96,4.31 R26.1
N$39
  Bottom 0.203: LED4.1 17.04,4.19 R27.1
N$40
  Bottom 0.203: R25.1 17.04,25.31 LED3.1
N$41
  Bottom 0.203: MIDI_IN.P$2_SWITCH 2.9,99.6 SJ3.2
N$42
  Bottom 0.203: LED3.3 11.96,25.31 R24.1
N$43
  Bottom 0.203: U1.6 21.05,69.25 22.5,70.7 22.5,77 Q1.1 23.6,78.3 C10.1
N$46
  Bottom 0.203: MIDI_THRU.P$2_SWITCH 26,99.5 SJ5.2
N$47
  Bottom 0.203: MIDI_THRU.P$1_TIP 26,105 SJ4.2
N$48
  Bottom 0.203: SJ5.3 27,103.4 | 27,103.4 SJ4.1 | R34.2 25.35,104.15 26.1,103.4 27,103.4
N$49  (via drill 0.4)
  Top 0.203: v28,102.24 26.24,102.24 25.23,103.25 23.77,103.25 23.71,103.19 v23.21,103.19
  Bottom 0.203: SJ4.3 27.48,106.52 28.2,105.8 28.2,102 | 28.2,102 28.2,98.5 27.68,97.98 SJ5.1 | 28.2,102 28,102.2 v28,102.24 | v23.21,103.19 22.87,102.85 R33.2
OUTA
  Bottom 0.203: U$1.1 6.24,63.08 7.65,61.67 9.95,61.67 10.7,60.92 12,60.92 13,59.92 13,54 14,53 20,53 21,52 R7.1
OUTB  (via drill 0.4)
  Top 0.203: v5,64.21 7.19,62.02 7.19,57.3 7,57.11 7,56.61 v6.97,56.58
  Bottom 0.203: U$1.2 4.62,63.83 v5,64.21 | v6.97,56.58 6.97,55.51 7.25,55.23 7.25,50.6 R10.1
OUTC
  Bottom 0.203: U$1.7 1.38,61.51 1.11,61.24 1.11,42.53 1.52,42.11 3.46,42.11 4.11,41.46 4.11,40.54 3.46,39.89 1.26,39.89 0.99,39.62 0.99,20.1 1.39,19.7 13.2,19.7 14.33,20.83 18.47,20.83 19.45,19.85 R13.1
OUTD
  Bottom 0.203: U$1.8 0.72,42.38 1.37,41.73 3.3,41.73 3.73,41.3 3.73,40.7 3.3,40.27 1.1,40.27 0.61,39.78 0.61,17 1.76,15.85 R16.1
REF_BIAS  (via drill 0.4)
  Top 0.203: v13,21 14,20 14,19 13,18 13,15 v14,14
  Bottom 0.203: R18.1 R19.2 12,52 13.5,50.5 13.5,48.42 12.3,47.22 12.3,45.2 13.4,44.09 | IC2.5 13.4,44.09 | 13.4,44.09 13.5,44 13.5,37.59 13.07,37.17 13.07,24.83 13.2,24.7 13.2,21.2 v13,21 | IC3.3 16.46,14 v14,14 12.6,12.6 IC3.5 | 13.4,44.09 14.68,45.37 IC2.3
RESET  (via drill 0.4)
  Top 0.203: v21.87,69.03 21.87,75.23 22.23,75.6 22.23,76.2 21.8,76.63 21.22,76.63 v19.97,77.89 | v21.74,79.78 24.77,82.81 SV2.4
  Bottom 0.203: C8.1 26.98,85.12 R17.1 27,83.01 SV2.4 | U1.7 18.87,68.87 21.21,68.87 21.37,69.03 v21.87,69.03 | v21.74,79.78 21.39,79.43 20.48,79.43 19.97,78.91 v19.97,77.89
SPI_LDAC
  Bottom 0.203: U$1.16 5.28,67.22 5.75,66.75 U1.26
SPI_MOSI
  Bottom 0.203: U1.27 6.15,67.25 5.71,67.69 5.71,71.73 5.52,71.92 2.48,71.92 2.02,71.46 U$1.11
SPI_SCK
  Bottom 0.203: U$1.10 1.38,71.35 2.33,72.3 5.67,72.3 6.09,71.89 6.09,68 6.34,67.75 U1.28
SPI_SYNC
  Bottom 0.203: U1.29 6.72,68.25 6.47,68.5 6.47,72.04 5.83,72.68 2.17,72.68 0.72,71.24 U$1.9
SWCLK  (via drill 0.4)
  Top 0.203: v11,74.62 11.16,74.78 14.49,74.78 15.4,75.7 15.4,76.41 18,79 25.53,79 SV2.3
  Bottom 0.203: U1.37 11,74 v11,74.62
SWDIO  (via drill 0.4)
  Top 0.203: v9,72.91 9.97,73.89 11.3,73.89 11.82,74.4 14.65,74.4 15.79,75.54 15.79,76.25 18.16,78.62 25.91,78.62 SV2.2
  Bottom 0.203: U1.34 8.79,70.75 8.47,71.07 8.47,72.38 v9,72.91
USB_DM
  Bottom 0.203: U1.32 8.71,69.75 7.62,70.84 7.62,77.16 9.19,78.73 14,78.73 14.17,78.73 14.72,78.73 R29.2
USB_DP
  Bottom 0.203: U1.33 8.75,70.25 8,71 8,77 8.95,77.95 R28.2 R30.1
VCCIO  (via drill 0.4)
  Top 0.203: v16,86.97 21.97,86.97 v23,88 | 11,81 11.1,80.9 v11.93,80.9
  Top 0.406: v20.33,67.6 20.33,75.06 v20.17,75.22 | v11.69,85.64 11,84.94 11,81 v11,76 11.42,76 12.15,75.27 13.93,75.27 v14.67,76 | v7,66 4,69 4,70 8,74 v9,74
  Bottom 0.203: U$4.8 19.31,98.15 R32.2 | R32.2 22.83,98.98 22.83,100.47 22.67,100.63 22.52,100.63 R33.1 | C3.1 15.53,86.5 v16,86.97 | R17.2 25.85,88 v23,88 23,91.06 24.07,92.13 24.07,93.27 22,95.34 R32.2 | U1.48 17.25,73.85 17.6,74.2 18.43,74.2 C17.1 19.6,73.03 19.6,72 19.35,71.75 U1.1 | U1.25 9.55,66.25 9.4,66.1 9.4,64.97 9.84,64.54 C18.1 10.47,63.9 11.5,63.9 11.75,64.15 U1.24 | U1.17 15.25,62.88 C15.1 | U1.9 19.45,67.75 19.7,67.5 19.7,66.98 20.55,66.12 C16.1 20.33,67.3 v20.33,67.6 | v11.93,80.9 12.25,80.9 R30.2 | U$1.12 2.67,70.65 C25.1 3.33,70.9 U$1.13 3.33,67.33 3,67 3.47,66.53 3.8,66.53 4.34,66 v7,66
  Bottom 0.406: U$2.1 10.95,87.2 C3.1 11.12,85.64 v11.69,85.64 | C15.1 14.88,61.98 14.3,61.4 10.9,61.4 10.15,62.15 | 9.84,64.54 9.84,62.46 10.15,62.15 | C17.1 20.17,74.8 v20.17,75.22 20.17,76.83 20,77 15.67,77 v14.67,76 | 10.15,62.15 7.85,62.15 7,63 v7,66 | v9,74 v11,76

### Text on the board
tPlace: Bitfox USBMIDI | v0.2
bPlace: v0.2